# EAGLE design working (EAGLE 6.5.0)
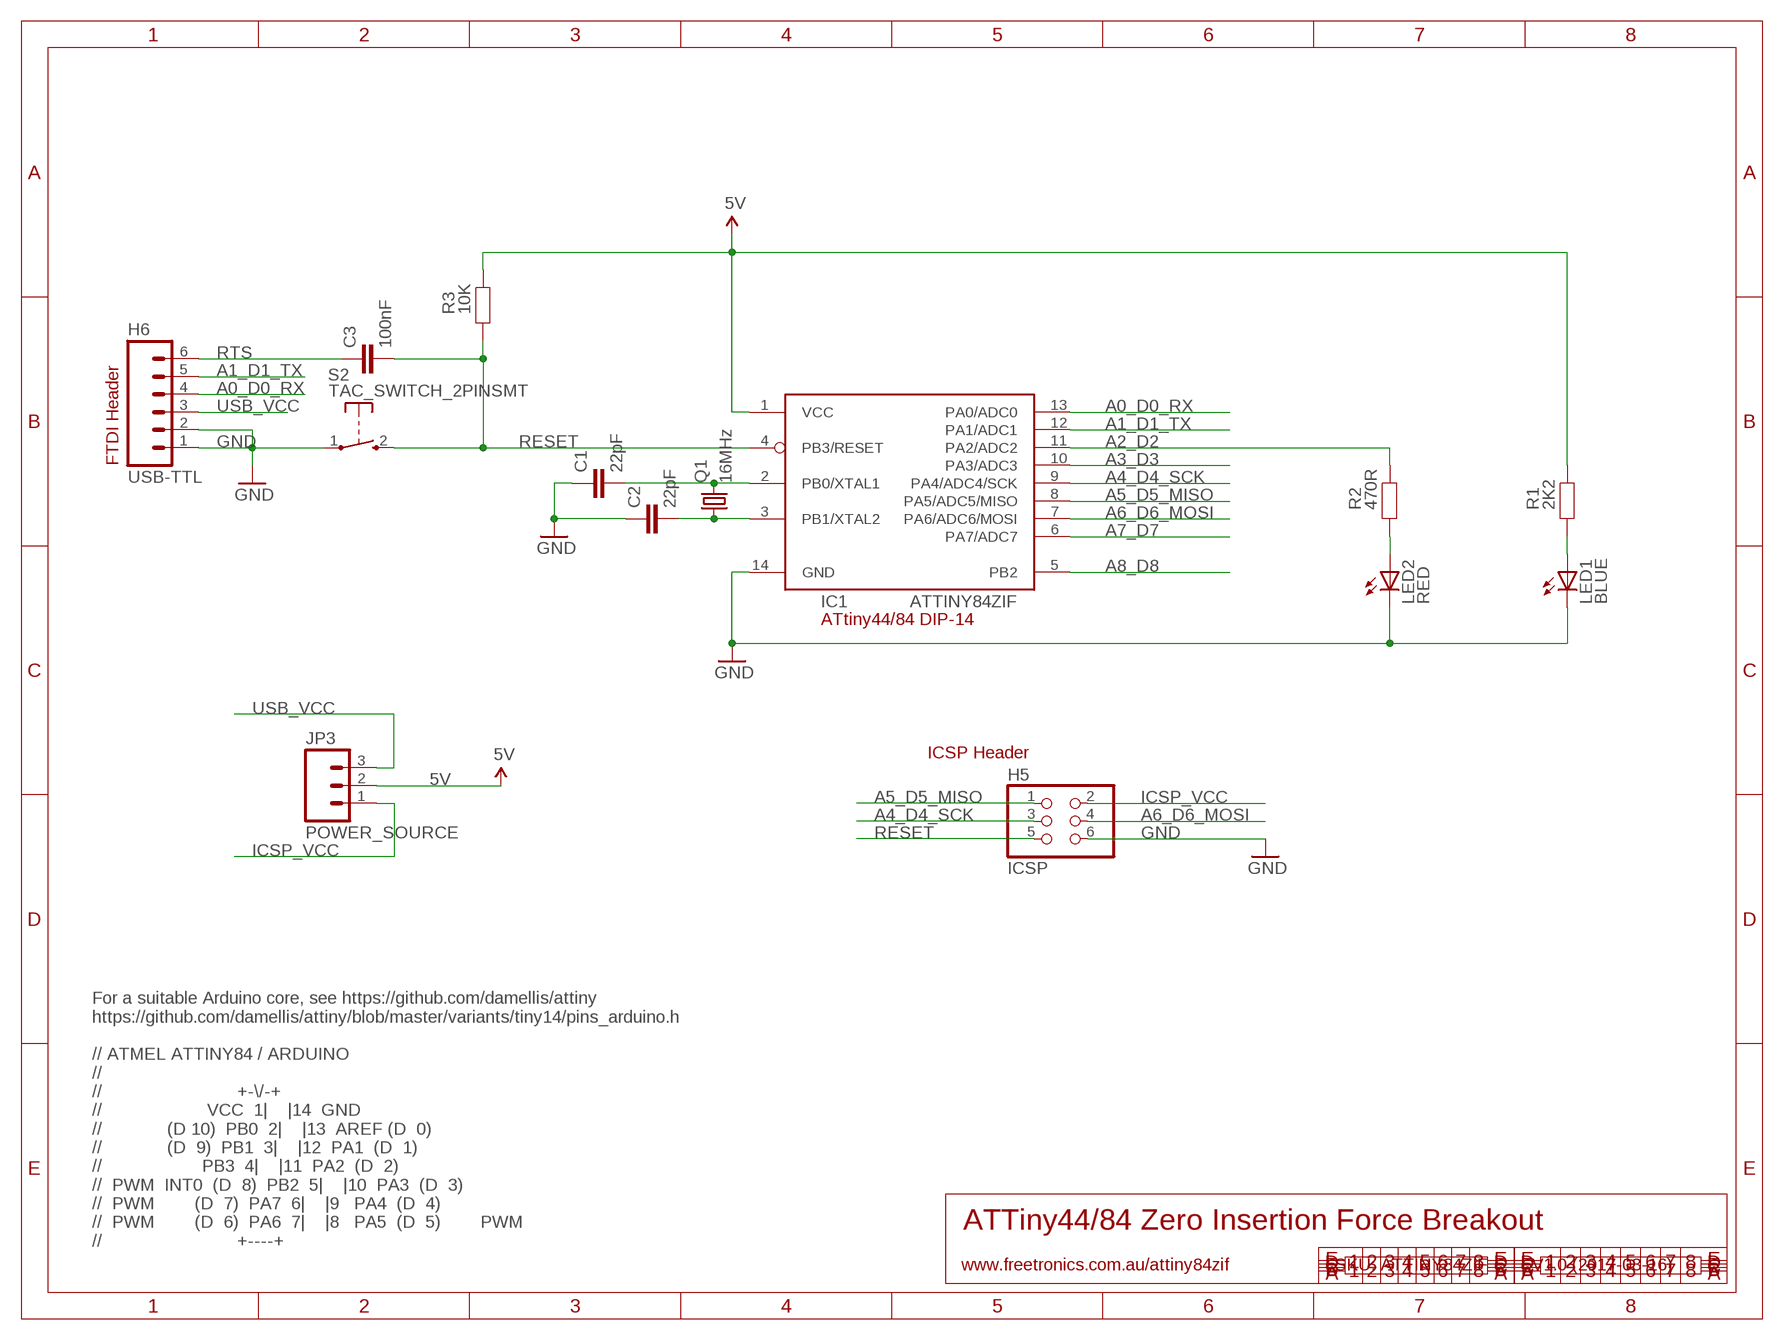
[diagram p0: schematic, sheet 1]

## Parts
C1  22pF  CAP0603  [0603]
C2  22pF  CAP0603  [0603]
C3  100nF  CAP0603  [0603]
H5  ICSP  PINHD-2X3  [2X03]
H6  USB-TTL  M06SIP  [1X06]
IC1  ATTINY84ZIF  [DIL14-3-ZIF]
JP3  POWER_SOURCE  M03PTH  [1X03]
LED1  BLUE  LED0603  [LED-0603]
LED2  RED  LED0603  [LED-0603]
Q1  16MHz  CRYSTALHC49US  [HC49US]
R1  2K2  RESISTOR0603  [0603]
R2  470R  RESISTOR0603  [0603]
R3  10K  RESISTOR0603  [0603]
S2  TAC_SWITCH_2PINSMT  [TACTILE_SWITCH_SMD_2PIN_TINY]

## Nets
5V: IC1.1(VCC) JP3.2 R1.2 R3.2
A0_D0_RX: H6.4 IC1.13(PA0/ADC0)
A1_D1_TX: H6.5 IC1.12(PA1/ADC1)
A2_D2: IC1.11(PA2/ADC2) R2.2
A3_D3: IC1.10(PA3/ADC3)
A4_D4_SCK: H5.3 IC1.9(PA4/ADC4/SCK)
A5_D5_MISO: H5.1 IC1.8(PA5/ADC5/MISO)
A6_D6_MOSI: H5.4 IC1.7(PA6/ADC6/MOSI)
A7_D7: IC1.6(PA7/ADC7)
A8_D8: IC1.5(PB2)
GND: C1.1 C2.1 H5.6 H6.1 H6.2 IC1.14(GND) LED1.C LED2.C S2.1(P)
ICSP_VCC: H5.2 JP3.1
N$1: C1.2 IC1.2(PB0/XTAL1) Q1.2
N$2: C2.2 IC1.3(PB1/XTAL2) Q1.1
N$3: LED1.A R1.1
N$4: LED2.A R2.1
RESET: C3.2 H5.5 IC1.4(PB3/RESET) R3.1 S2.2(S)
RTS: C3.1 H6.6
USB_VCC: H6.3 JP3.3

## Notes on the sheet
- FTDI Header
- ATtiny44/84 DIP-14
- ICSP Header
- ATTiny44/84 Zero Insertion Force Breakout
- For a suitable Arduino core, see https://github.com/damellis/attiny
  https://github.com/damellis/attiny/blob/master/variants/tiny14/pins_arduino.h
  
  // ATMEL ATTINY84 / ARDUINO
  //
  //                           +-\/-+
  //                     VCC  1|    |14  GND
  //             (D 10)  PB0  2|    |13  AREF (D  0)
  //             (D  9)  PB1  3|    |12  PA1  (D  1) 
  //                    PB3  4|    |11  PA2  (D  2) 
  //  PWM  INT0  (D  8)  PB2  5|    |10  PA3  (D  3) 
  //  PWM        (D  7)  PA7  6|    |9   PA4  (D  4) 
  //  PWM        (D  6)  PA6  7|    |8   PA5  (D  5)        PWM
  //                           +----+
- www.freetronics.com.au/attiny84zif | SKU: ATTINY84ZIF | V1.0 (2017-03-16)

## Library data of the parts
C1-C3 = freetronics-jon:CAP: Capacitor Standard 0603 ceramic capacitor, and 0.1" leaded capacitor.
H5 = pinhead:PINHD-2X3: PIN HEADER
H6 = freetronics:M06: Header 6 Standard 6-pin 0.1" header. Use with straight break away headers (SKU : PRT-00116), right angle break away headers (PRT-00553), swiss pins (PRT-00743), machine pins (PRT-00117), and female headers (PRT-00115). Molex polarized connector foot print use with SKU : PRT-08094 with associated crimp pins and housings. NOTES ON THE VARIANTS LOCK and LOCK_LONGPADS... This footprint was designed to help hold the alignment of a through-hole component (i.e. 6-pin header) while soldering it into place. You may notice that each hole has been shifted either up or down by 0.005 of an inch from it's more standard position (which is a perfectly straight line). This slight alteration caused the pins (the squares in the middle) to touch the edges of the holes. Because they are alternating, it causes a "brace" to hold the component in place. 0.005 has proven to be the perfect amount of "off-center" position when using our standard breakaway headers. Although looks a little odd when you look at the bare footprint, once you have a header in there, the alteration is very hard to notice. Also, if you push a header all the way into place, it is covered up entirely on the bottom side. This idea of altering the position of holes to aid alignment will be further integrated into the Sparkfun Library for other footprints. It can help hold any component with 3 or more connection pins.
IC1 = freetronics-jon:ATTINY84
JP3 = freetronics-jon:M03: Header 3 Standard 3-pin 0.1" header. Use with straight break away headers (SKU : PRT-00116), right angle break away headers (PRT-00553), swiss pins (PRT-00743), machine pins (PRT-00117), and female headers (PRT-00115). Molex polarized connector foot print use with SKU : PRT-08232 with associated crimp pins and housings.
LED1 LED2 = freetronics-jon:LED: LEDs Standard schematic elements and footprints for 5mm, 3mm, 1206, and 0603 sized LEDs. 5mm - Spark Fun Electronics SKU : COM-00529 (and others)
Q1 = freetronics-jon:CRYSTAL: Crystals Various standard crystals. Proven footprints. Spark Fun Electronics SKU : COM-00534
R1-R3 = freetronics-jon:RESISTOR: Resistor Basic schematic elements and footprints for 0603, 1206, and PTH 1/10th watt (small) resistors.
S2 = freetronics-jon:TAC_SWITCH_2PIN: Momentary Tactile Switch - 2 pin

## Board
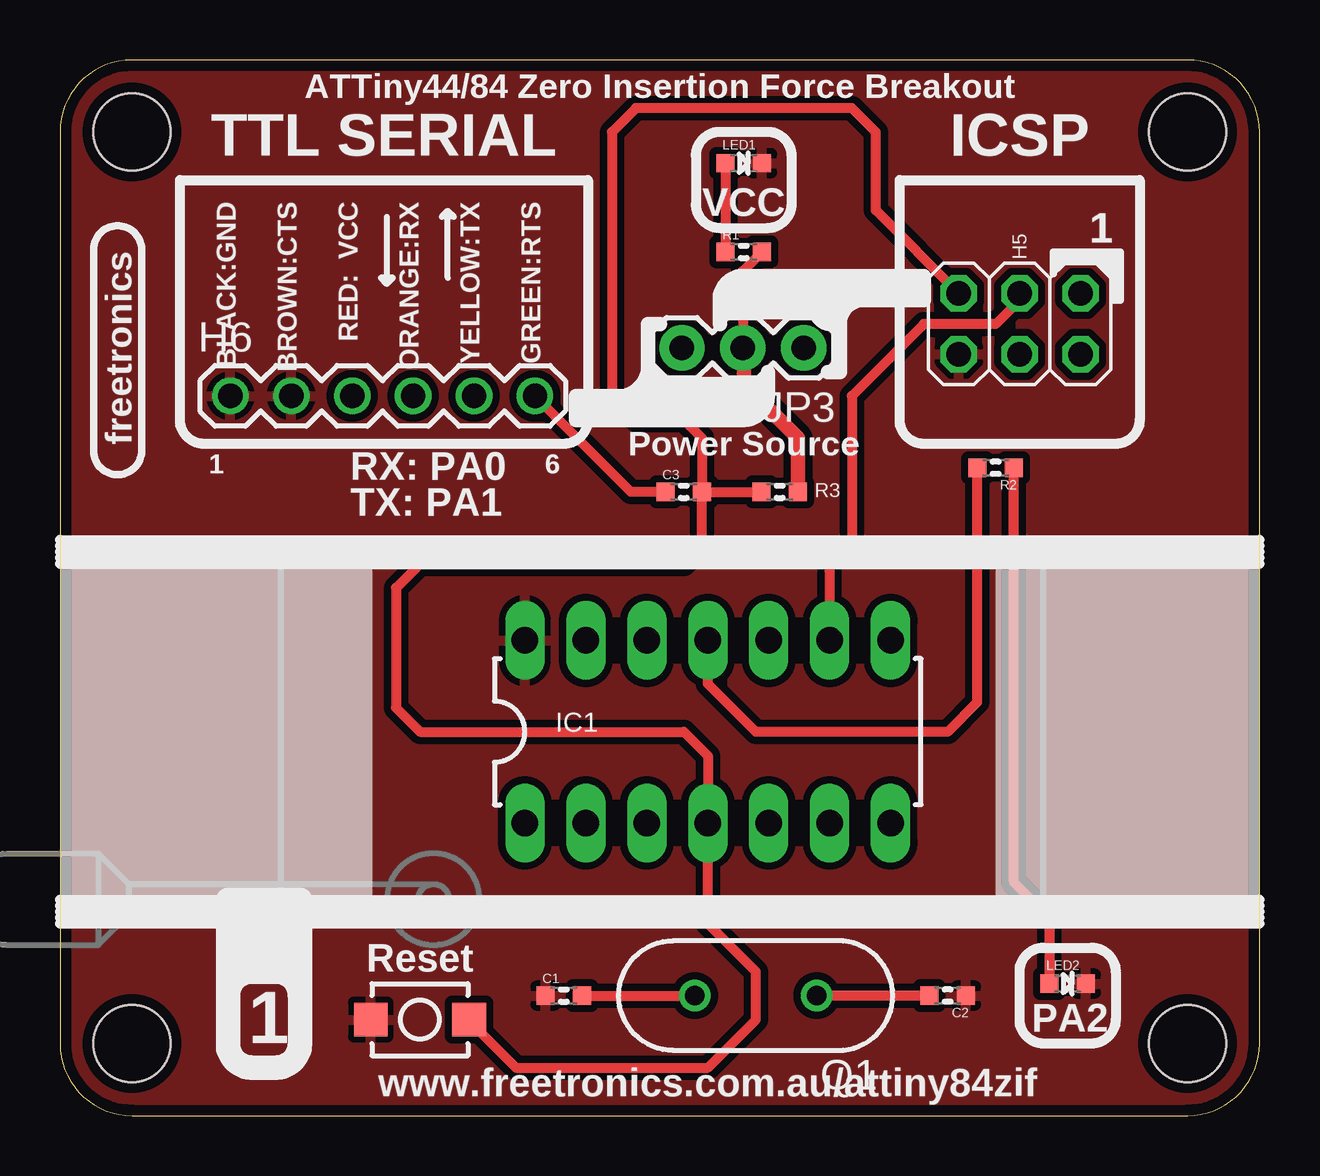
[diagram p1: board, top side]
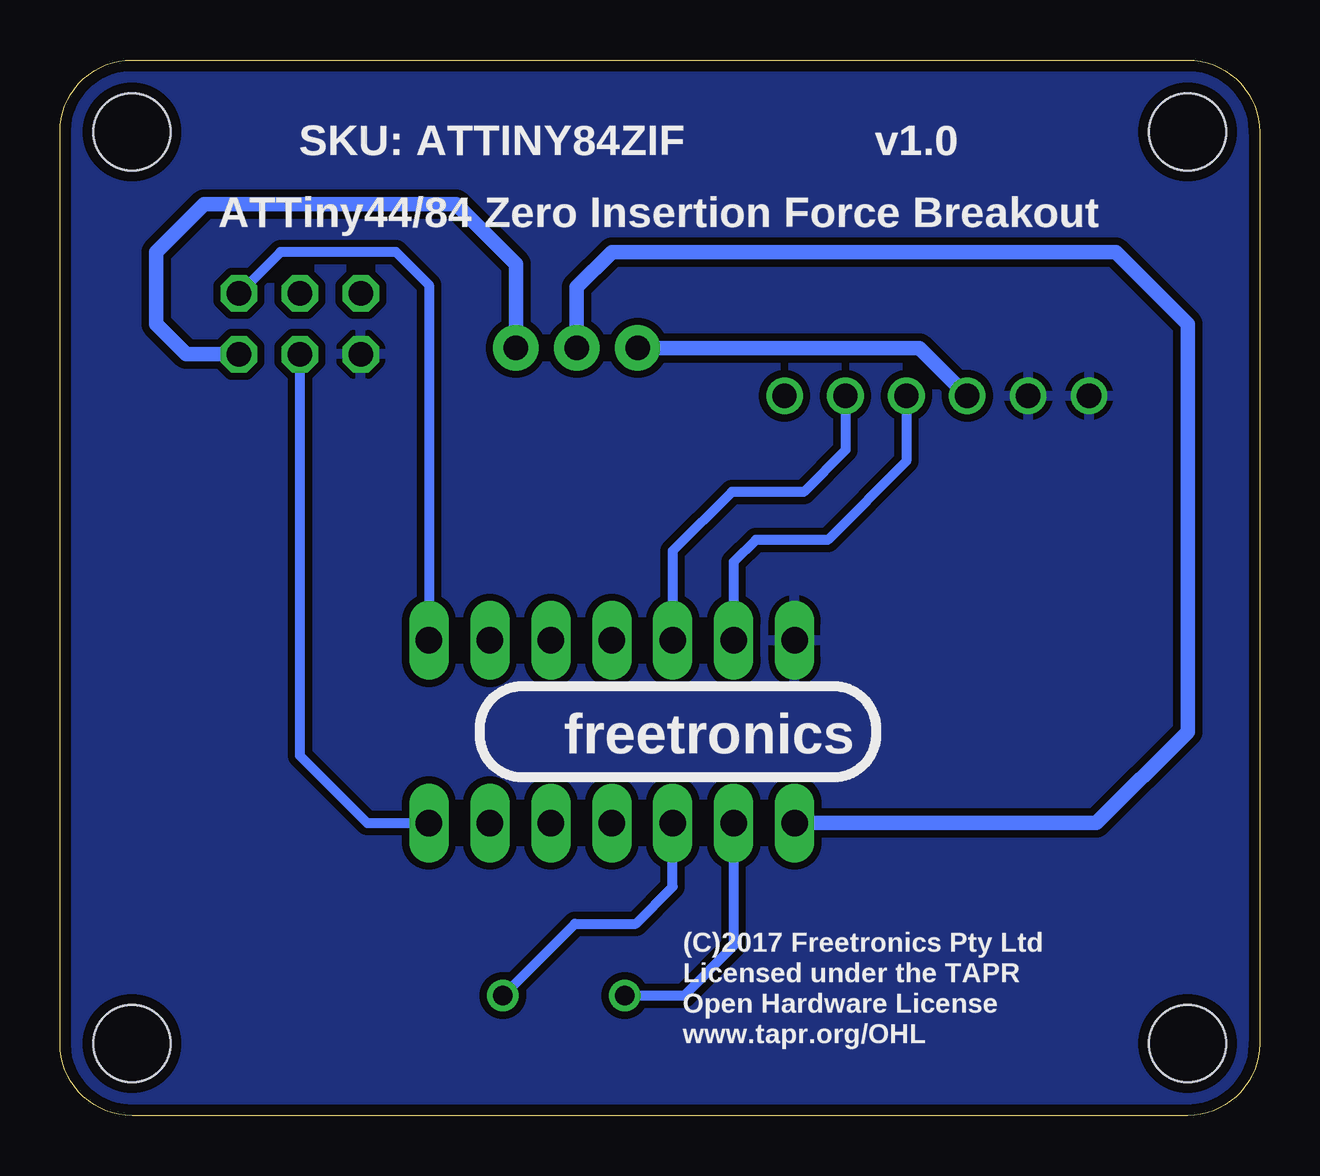
[diagram p2: board, bottom side, seen from below]

Size 50 x 44 mm. Coordinates in mm from the lower left corner, seen from the top.
Outline: 0,3 arc90 3,0 47,0 arc90 50,3 50,41 arc90 47,44 3,44 arc90 0,41 0,3
Copper layers (1*16): Top 0.035mm / dielectric 1.5mm / Bottom 0.035mm
Design rules "default *": minimum track width 10mil, minimum drill 18mil, track to track 10mil, track to pad 10mil, pad to pad 10mil, via to via 10mil, smd to smd 8mil, copper to edge 18mil, drill to drill 8mil, minimum pad ring 10mil, minimum via ring 8mil, stop-mask expansion 4mil, vias tented up to drill 25mil, thermal gap 10mil
Holes 3.2 mm at 47,41 47,3 3,41 3,3

### Footprints (pad centres in the part's own frame; a part is rotated, then mirrored left to right if it is on the bottom)
0603 = smd 0.762 x 0.762: 1 -0.762,0; 2 0.762,0
2X03 = drill 1.016 octagon: 1 -2.54,-1.27; 2 -2.54,1.27; 3 0,-1.27; 4 0,1.27; 5 2.54,-1.27; 6 2.54,1.27
1X06 = drill 1.016: 1 0,0; 2 2.54,0; 3 5.08,0; 4 7.62,0; 5 10.16,0; 6 12.7,0
DIL14-3-ZIF = drill 1.1 long: 1 -7.62,-3.81; 2 -5.08,-3.81; 3 -2.54,-3.81; 4 0,-3.81; 5 2.54,-3.81; 6 5.08,-3.81; 7 7.62,-3.81; 8 7.62,3.81; 9 5.08,3.81; 10 2.54,3.81; 11 0,3.81; 12 -2.54,3.81; 13 -5.08,3.81; 14 -7.62,3.81
1X03 = drill 1.016 pad 1.88: 1 0,0; 2 2.54,0; 3 5.08,0
LED-0603 = smd 0.762 x 0.762: A -0.762,0; C 0.762,0
HC49US = drill 0.813: 1 -2.54,0; 2 2.54,0
TACTILE_SWITCH_SMD_2PIN_TINY = smd 1.4 x 1.4: 1 -2.05,0; 2 2.05,0

### Placement (x,y rotation side)
C1  21,5 0 top
C2  37,5 180 top
C3  26,26 0 top
H5  40,33 180 top
H6  7.1,30 0 top
IC1  27,16 0 top
JP3  31,32 180 top
LED1  28.5,39.7 0 top
LED2  42,5.5 0 top
Q1  29,5 180 top
R1  28.5,36 0 top
R2  39,27 180 top
R3  30,26 0 top
S2  15,4 0 top

### Tracks (layer width: path | path; a pad name or v marks a point on that pad's centre or on a via)
5V
  Top 0.406: R1.2 28.46,35.2 JP3.2
  Top 0.61: R3.2 30.76,28.24 28.5,30.5 28.5,31.96 JP3.2
  Bottom 0.61: IC1.1 6.81,12.19 3,16 3,33 6,36 27,36 28.46,34.54 JP3.2
A0_D0_RX
  Bottom 0.406: H6.4 14.72,27.28 18,24 21,24 21.92,23.08 IC1.13
A1_D1_TX
  Bottom 0.406: H6.5 17.26,27.74 19,26 22,26 24.46,23.54 IC1.12
A2_D2
  Top 0.406: IC1.11 27,18 29,16 37,16 38.24,17.24 R2.2
A4_D4_SCK
  Top 0.305: H5.3 40,34
  Top 0.406: 40,34 39,33 36,33 33,30 33,24 32.08,23.08 IC1.9
A5_D5_MISO
  Bottom 0.406: H5.1 40.81,36 36,36 34.62,34.62 IC1.8
A6_D6_MOSI
  Bottom 0.406: H5.4 40,15 37.19,12.19 IC1.7
GND
  pour Bottom (isolate 0.305): 0,41 arc-90 3,44 47,44 arc-90 50,41 50,3 arc-90 47,0 3,0 arc-90 0,3
  pour Top (isolate 0.305): 0,41 arc-90 3,44 47,44 arc-90 50,41 50,3 arc-90 47,0 3,0 arc-90 0,3
ICSP_VCC
  Bottom 0.61: JP3.1 31,35.5 33.5,38 44,38 46,36 46,33 44.73,31.73 H5.2
N$1
  Top 0.406: C1.2 Q1.2
  Bottom 0.406: IC1.2 21.92,7.08 24,5 Q1.2
N$2
  Top 0.406: C2.2 Q1.1
  Bottom 0.406: Q1.1 28.54,8 26,8 24.46,9.54 IC1.3
N$3
  Top 0.406: LED1.A R1.1
N$4
  Top 0.406: LED2.A 41.24,8.24 39.76,9.71 R2.1
RESET
  Top 0.406: C3.2 R3.1 | C3.2 26.76,23.76 26,23 15,23 14,22 14,17 15,16 26,16 27,15 IC1.4 27,8 29,6 29,4 27,2 19,2 17.05,3.95 S2.2 | H5.5 34,37.73 34,41 33,42 24,42 23,41 23,30 24,29 26,29 26.76,28.24 C3.2
RTS
  Top 0.406: C3.1 23.8,26 H6.6
USB_VCC
  Bottom 0.61: JP3.3 14.18,32 H6.3

### Text on the board
tPlace: ATTiny44/84 Zero Insertion Force Breakout | TTL SERIAL | ICSP | BLACK:GND | BROWN:CTS | RED: VCC | ORANGE:RX | YELLOW:TX | GREEN:RTS | VCC | 1 | freetronics | Power Source | 1 | 6 | RX: PA0 | TX: PA1 | Reset | PA2 | 1 | www.freetronics.com.au/attiny84zif
bPlace: v1.0 | SKU: ATTINY84ZIF | ATTiny44/84 Zero Insertion Force Breakout | freetronics | (C)2017 Freetronics Pty Ltd | Licensed under the TAPR | Open Hardware License | www.tapr.org/OHL